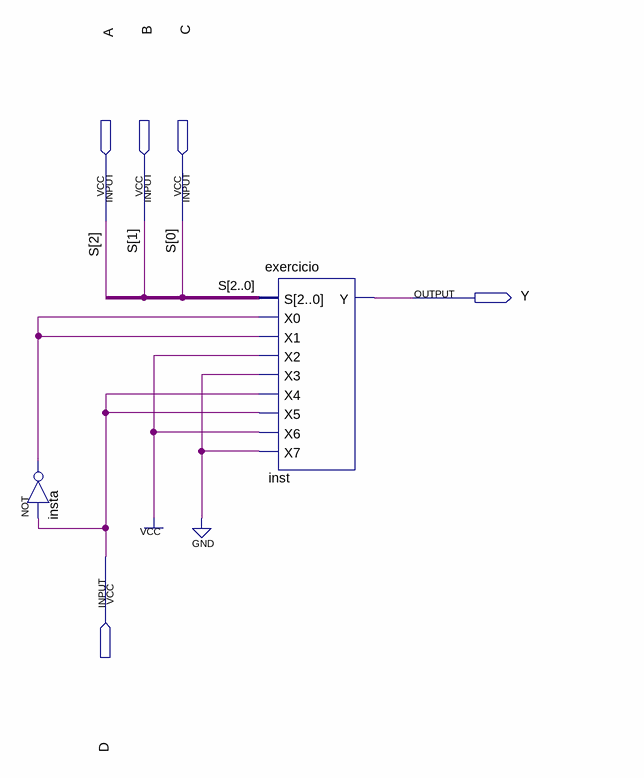
[diagram p0: schematic sheet]
// Quartus schematic block_use.bdf as structural Verilog: 2 symbols, 5 pins
module block_use (
  input  A,
  input  B,
  input  C,
  input  D,
  output Y
);

  wire insta_out;

  not insta (insta_out, D);
  exercicio inst (
    .S({A, B, C}), .X0(insta_out), .X1(insta_out), .X2(1'b1), .X3(1'b0), .X4(D), .X5(D), .X6(1'b1),
    .X7(1'b0), .Y(Y));

  // Other names for the same wires on the sheet: S[2:0] = {A, B, C}
endmodule
